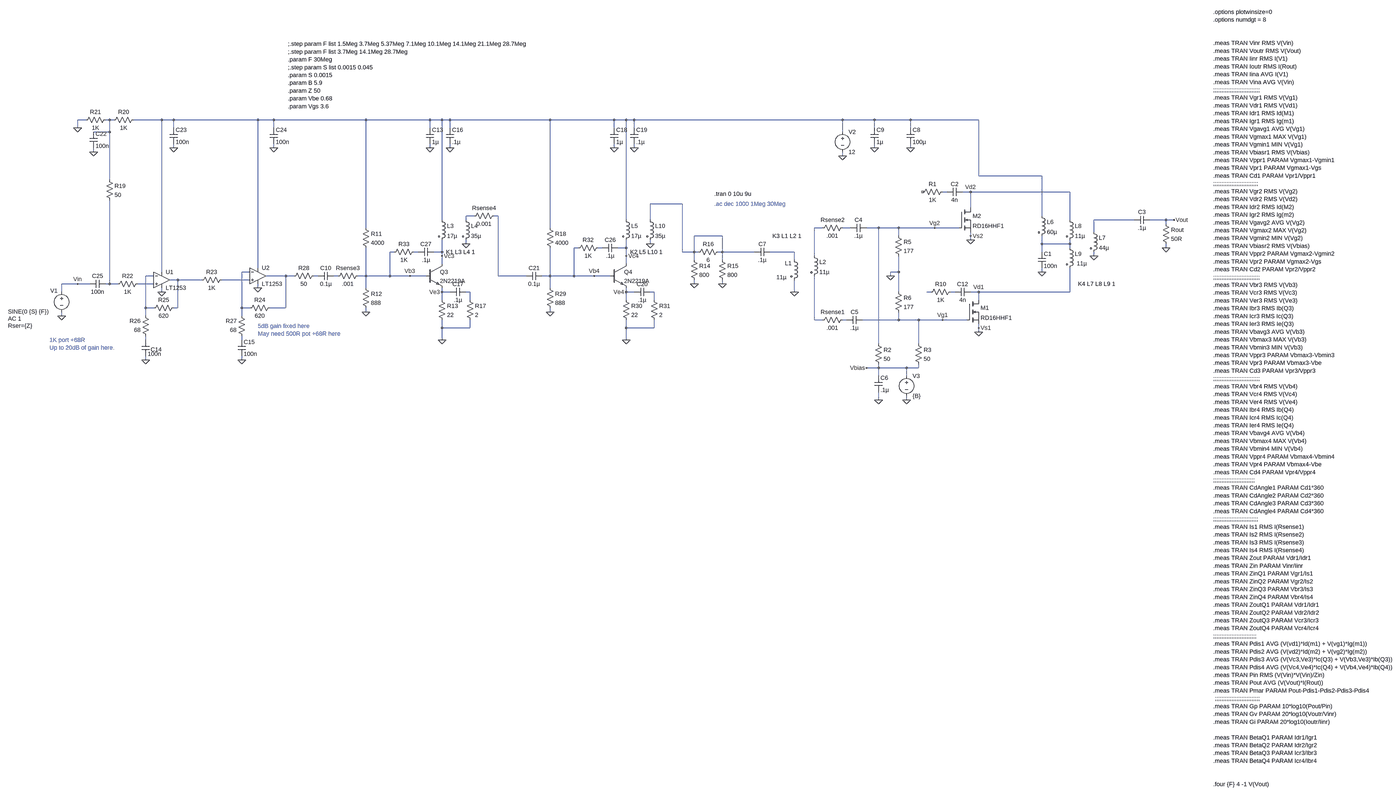
[diagram p0: schematic LT1253+2N2219+RD16HHF Push-Pull testing.asc, whole sheet]
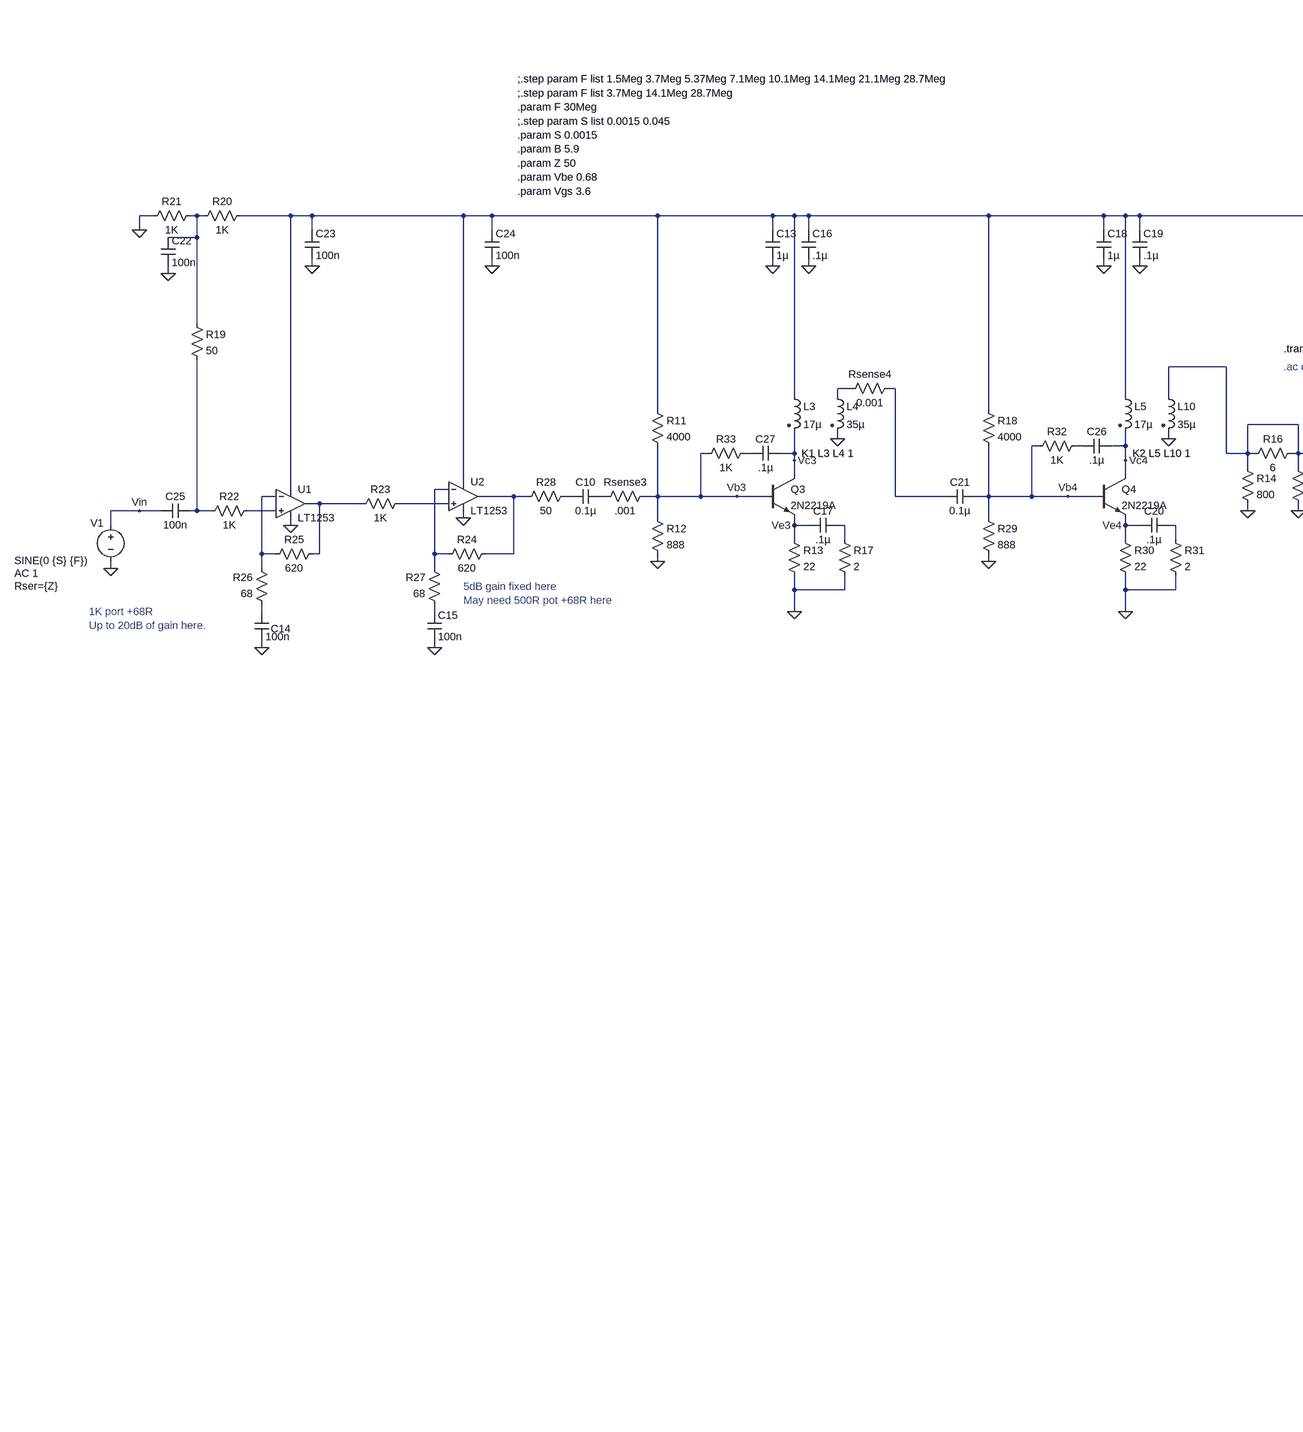
[diagram p1: schematic LT1253+2N2219+RD16HHF Push-Pull testing.asc, part, row 1 of 1, column 1 of 2]
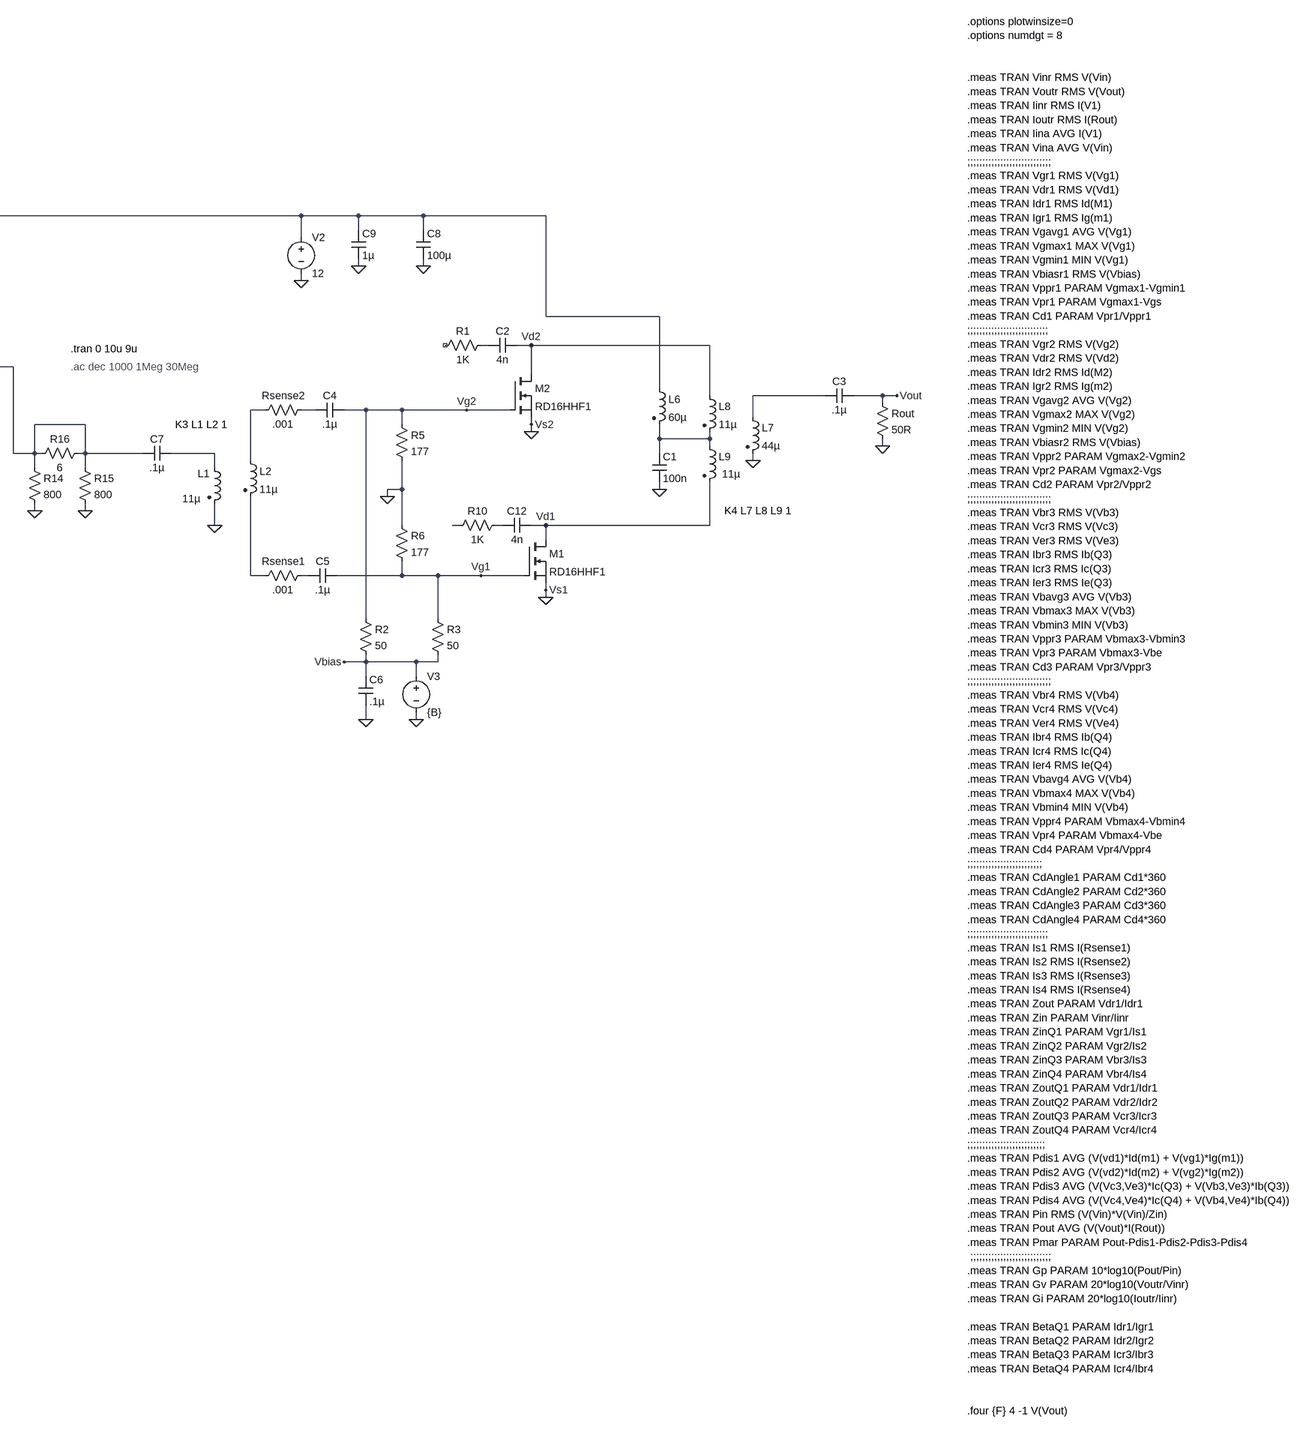
[diagram p2: schematic LT1253+2N2219+RD16HHF Push-Pull testing.asc, part, row 1 of 1, column 2 of 2]
LT1253+2N2219+RD16HHF Push-Pull testing.asc, the LTspice schematic file:
Version 4
SHEET 1 3748 1760
WIRE -2544 -624 -2576 -624
WIRE -2448 -624 -2464 -624
WIRE -2432 -624 -2448 -624
WIRE -2240 -624 -2352 -624
WIRE -2192 -624 -2240 -624
WIRE -1856 -624 -2192 -624
WIRE -1792 -624 -1856 -624
WIRE -1424 -624 -1792 -624
WIRE -1168 -624 -1424 -624
WIRE -1120 -624 -1168 -624
WIRE -1088 -624 -1120 -624
WIRE -688 -624 -1088 -624
WIRE -432 -624 -688 -624
WIRE -384 -624 -432 -624
WIRE -352 -624 -384 -624
WIRE 480 -624 -352 -624
WIRE 608 -624 480 -624
WIRE 752 -624 608 -624
WIRE 1024 -624 752 -624
WIRE -2576 -592 -2576 -624
WIRE -2192 -592 -2192 -624
WIRE -1792 -592 -1792 -624
WIRE -1168 -592 -1168 -624
WIRE -1088 -592 -1088 -624
WIRE -432 -592 -432 -624
WIRE -352 -592 -352 -624
WIRE 608 -592 608 -624
WIRE 752 -592 752 -624
WIRE -2448 -576 -2448 -624
WIRE -2448 -576 -2512 -576
WIRE 480 -576 480 -624
WIRE -2192 -512 -2192 -528
WIRE -1792 -512 -1792 -528
WIRE -1168 -512 -1168 -528
WIRE -1088 -512 -1088 -528
WIRE -432 -512 -432 -528
WIRE -352 -512 -352 -528
WIRE 608 -512 608 -528
WIRE 752 -512 752 -528
WIRE -2512 -496 -2512 -512
WIRE 480 -480 480 -496
WIRE 1024 -400 1024 -624
WIRE 1280 -400 1024 -400
WIRE -2448 -384 -2448 -576
WIRE 896 -336 880 -336
WIRE 992 -336 960 -336
WIRE 1392 -336 992 -336
WIRE -160 -288 -288 -288
WIRE 992 -272 992 -336
WIRE -992 -240 -1024 -240
WIRE -896 -240 -912 -240
WIRE 1280 -240 1280 -400
WIRE -1120 -224 -1120 -624
WIRE -1024 -224 -1024 -240
WIRE -384 -224 -384 -624
WIRE -288 -224 -288 -288
WIRE 1392 -224 1392 -336
WIRE 1648 -224 1488 -224
WIRE 1776 -224 1712 -224
WIRE 1808 -224 1776 -224
WIRE 1776 -208 1776 -224
WIRE -1424 -192 -1424 -624
WIRE -688 -192 -688 -624
WIRE 400 -192 368 -192
WIRE 512 -192 480 -192
WIRE 624 -192 576 -192
WIRE 704 -192 624 -192
WIRE 848 -192 704 -192
WIRE 944 -192 848 -192
WIRE 1488 -176 1488 -224
WIRE 0 -160 -112 -160
WIRE 704 -160 704 -192
WIRE 992 -160 992 -176
WIRE 992 -144 992 -160
WIRE -1024 -128 -1024 -144
WIRE -288 -128 -288 -144
WIRE 1280 -128 1280 -160
WIRE 1392 -128 1392 -144
WIRE 1392 -128 1280 -128
WIRE -576 -112 -592 -112
WIRE -480 -112 -496 -112
WIRE -384 -112 -384 -144
WIRE -384 -112 -416 -112
WIRE 1392 -112 1392 -128
WIRE 1776 -112 1776 -128
WIRE -1312 -96 -1328 -96
WIRE -1216 -96 -1232 -96
WIRE -1120 -96 -1120 -144
WIRE -1120 -96 -1152 -96
WIRE -160 -96 -160 -288
WIRE -112 -96 -112 -160
WIRE -112 -96 -160 -96
WIRE -96 -96 -112 -96
WIRE 0 -96 0 -160
WIRE 0 -96 -16 -96
WIRE 128 -96 0 -96
WIRE 288 -96 192 -96
WIRE 1280 -96 1280 -128
WIRE -1120 -80 -1120 -96
WIRE -384 -80 -384 -112
WIRE 368 -80 368 -192
WIRE 1488 -80 1488 -96
WIRE -112 -64 -112 -96
WIRE 0 -64 0 -96
WIRE 288 -64 288 -96
WIRE -1120 -48 -1120 -80
WIRE -384 -48 -384 -80
WIRE -1856 -32 -1856 -624
WIRE -2240 -16 -2240 -624
WIRE -1888 -16 -1920 -16
WIRE 704 -16 704 -80
WIRE 704 -16 672 -16
WIRE 1280 -16 1280 -32
WIRE -2272 0 -2304 0
WIRE -1744 0 -1824 0
WIRE -1712 0 -1744 0
WIRE -1616 0 -1632 0
WIRE -1536 0 -1552 0
WIRE -1424 0 -1424 -112
WIRE -1424 0 -1456 0
WIRE -1328 0 -1328 -96
WIRE -1328 0 -1424 0
WIRE -1248 0 -1328 0
WIRE -1184 0 -1248 0
WIRE -896 0 -896 -240
WIRE -784 0 -896 0
WIRE -688 0 -688 -112
WIRE -688 0 -720 0
WIRE -592 0 -592 -112
WIRE -592 0 -688 0
WIRE -512 0 -592 0
WIRE -448 0 -512 0
WIRE 672 0 672 -16
WIRE -2176 16 -2208 16
WIRE -2080 16 -2176 16
WIRE -1888 16 -2000 16
WIRE -2576 32 -2640 32
WIRE -2528 32 -2576 32
WIRE -2448 32 -2448 -304
WIRE -2448 32 -2464 32
WIRE -2416 32 -2448 32
WIRE -2272 32 -2336 32
WIRE -112 32 -112 16
WIRE 0 32 0 16
WIRE -1856 48 -1856 32
WIRE -1424 48 -1424 0
WIRE -688 48 -688 0
WIRE -2640 64 -2640 32
WIRE -2240 64 -2240 48
WIRE -1120 64 -1120 48
WIRE -1088 64 -1120 64
WIRE -1008 64 -1024 64
WIRE -384 64 -384 48
WIRE -352 64 -384 64
WIRE -272 64 -288 64
WIRE 288 64 288 16
WIRE 704 64 704 -16
WIRE 832 64 816 64
WIRE 928 64 912 64
WIRE 1024 64 992 64
WIRE 1392 64 1392 -32
WIRE 1392 64 1024 64
WIRE -1120 96 -1120 64
WIRE -1008 96 -1008 64
WIRE -384 96 -384 64
WIRE -272 96 -272 64
WIRE 1024 96 1024 64
WIRE -2304 128 -2304 0
WIRE -2272 128 -2304 128
WIRE -2176 128 -2176 16
WIRE -2176 128 -2192 128
WIRE -1920 128 -1920 -16
WIRE -1888 128 -1920 128
WIRE -1744 128 -1744 0
WIRE -1744 128 -1808 128
WIRE -1424 144 -1424 128
WIRE -688 144 -688 128
WIRE -2640 160 -2640 144
WIRE -2304 160 -2304 128
WIRE -1920 160 -1920 128
WIRE 368 176 368 0
WIRE 400 176 368 176
WIRE 496 176 480 176
WIRE 704 176 704 144
WIRE 704 176 560 176
WIRE 784 176 704 176
WIRE 880 176 784 176
WIRE 976 176 880 176
WIRE -1120 208 -1120 176
WIRE -1008 208 -1008 176
WIRE -1008 208 -1120 208
WIRE -384 208 -384 176
WIRE -272 208 -272 176
WIRE -272 208 -384 208
WIRE 1024 208 1024 192
WIRE 1024 224 1024 208
WIRE -2304 256 -2304 240
WIRE -1920 256 -1920 240
WIRE -1120 256 -1120 208
WIRE -384 256 -384 208
WIRE 624 272 624 -192
WIRE 784 272 784 176
WIRE -2304 336 -2304 320
WIRE -1920 336 -1920 320
WIRE 624 368 624 352
WIRE 624 368 576 368
WIRE 736 368 624 368
WIRE 784 368 784 352
WIRE 784 368 736 368
WIRE 624 400 624 368
WIRE 736 400 736 368
WIRE 624 496 624 464
WIRE 736 496 736 480
FLAG 480 -480 0
FLAG -2640 160 0
FLAG 1808 -224 Vout
FLAG 1776 -112 0
FLAG 880 176 Vg1
FLAG -2576 32 Vin
FLAG 288 64 0
FLAG 672 0 0
FLAG 1280 -16 0
FLAG 608 -512 0
FLAG 1488 -80 0
FLAG 752 -512 0
FLAG -112 32 0
FLAG 0 32 0
FLAG -2192 -512 0
FLAG -2512 -496 0
FLAG -2240 64 0
FLAG -1856 48 0
FLAG -1920 336 0
FLAG -1792 -512 0
FLAG -2576 -592 0
FLAG -2304 336 0
FLAG -1424 144 0
FLAG -1120 256 0
FLAG -1168 -512 0
FLAG -1088 -512 0
FLAG -1248 0 Vb3
FLAG -1120 64 Ve3
FLAG -1120 -80 Vc3
FLAG -1024 -128 0
FLAG -688 144 0
FLAG -384 256 0
FLAG -432 -512 0
FLAG -352 -512 0
FLAG -512 0 Vb4
FLAG -384 64 Ve4
FLAG -384 -80 Vc4
FLAG -288 -128 0
FLAG 1024 64 Vd1
FLAG 1024 224 0
FLAG 1024 208 Vs1
FLAG 848 -192 Vg2
FLAG 992 -336 Vd2
FLAG 992 -144 0
FLAG 992 -160 Vs2
FLAG 736 496 0
FLAG 624 496 0
FLAG 576 368 Vbias
SYMBOL voltage -2640 48 R0
WINDOW 0 -45 11 Left 2
WINDOW 3 -214 95 Left 2
WINDOW 123 -214 123 Left 2
WINDOW 39 -214 151 Left 2
SYMATTR InstName V1
SYMATTR Value SINE(0 {S} {F})
SYMATTR Value2 AC 1
SYMATTR SpiceLine Rser={Z}
SYMBOL voltage 480 -592 R0
WINDOW 123 0 0 Left 0
WINDOW 39 0 0 Left 0
SYMATTR InstName V2
SYMATTR Value 12
SYMBOL cap 1712 -240 R90
WINDOW 0 0 32 VBottom 2
WINDOW 3 32 32 VTop 2
SYMATTR InstName C3
SYMATTR Value .1µ
SYMBOL res 1760 -224 R0
SYMATTR InstName Rout
SYMATTR Value 50R
SYMBOL cap 192 -112 R90
WINDOW 0 0 32 VBottom 2
WINDOW 3 32 32 VTop 2
SYMATTR InstName C7
SYMATTR Value .1µ
SYMBOL ind2 272 -80 R0
WINDOW 0 -22 29 Left 2
WINDOW 3 -56 85 Left 2
SYMATTR InstName L1
SYMATTR Value 11µ
SYMATTR Type ind
SYMBOL ind2 352 -96 R0
SYMATTR InstName L2
SYMATTR Value 11µ
SYMATTR Type ind
SYMBOL res 688 -176 R0
SYMATTR InstName R5
SYMATTR Value 177
SYMBOL res 688 48 R0
SYMATTR InstName R6
SYMATTR Value 177
SYMBOL ind2 1376 -240 R0
SYMATTR InstName L8
SYMATTR Value 11µ
SYMATTR Type ind
SYMBOL ind2 1376 -128 R0
WINDOW 3 43 78 Left 2
SYMATTR Value 11µ
SYMATTR InstName L9
SYMATTR Type ind
SYMBOL ind2 1472 -192 R0
SYMATTR InstName L7
SYMATTR Value 44µ
SYMATTR Type ind
SYMBOL ind2 1264 -256 R0
SYMATTR InstName L6
SYMATTR Value 60µ
SYMATTR Type ind
SYMBOL cap 1264 -96 R0
SYMATTR InstName C1
SYMATTR Value 100n
SYMBOL cap 592 -592 R0
SYMATTR InstName C9
SYMATTR Value 1µ
SYMBOL cap 736 -592 R0
SYMATTR InstName C8
SYMATTR Value 100µ
SYMBOL res 496 -208 R90
WINDOW 0 0 56 VBottom 2
WINDOW 3 32 56 VTop 2
SYMATTR InstName Rsense2
SYMATTR Value .001
SYMBOL res 496 160 R90
WINDOW 0 0 56 VBottom 2
WINDOW 3 32 56 VTop 2
SYMATTR InstName Rsense1
SYMATTR Value .001
SYMBOL cap 576 -208 R90
WINDOW 0 0 32 VBottom 2
WINDOW 3 32 32 VTop 2
SYMATTR InstName C4
SYMATTR Value .1µ
SYMBOL cap 560 160 R90
WINDOW 0 0 32 VBottom 2
WINDOW 3 32 32 VTop 2
SYMATTR InstName C5
SYMATTR Value .1µ
SYMBOL cap 992 48 R90
WINDOW 0 0 32 VBottom 2
WINDOW 3 32 32 VTop 2
SYMATTR InstName C12
SYMATTR Value 4n
SYMBOL res 928 48 R90
WINDOW 0 0 56 VBottom 2
WINDOW 3 32 56 VTop 2
SYMATTR InstName R10
SYMATTR Value 1K
SYMBOL res -128 -80 R0
SYMATTR InstName R14
SYMATTR Value 800
SYMBOL res -16 -80 R0
SYMATTR InstName R15
SYMATTR Value 800
SYMBOL res 0 -112 R90
WINDOW 0 0 56 VBottom 2
WINDOW 3 32 56 VTop 2
SYMATTR InstName R16
SYMATTR Value 6
SYMBOL Opamps\\LT1253 -2240 -48 R0
SYMATTR InstName U1
SYMBOL Opamps\\LT1253 -1856 -64 R0
SYMATTR InstName U2
SYMBOL res -2464 -400 R0
SYMATTR InstName R19
SYMATTR Value 50
SYMBOL res -2336 -640 R90
WINDOW 0 0 56 VBottom 2
WINDOW 3 32 56 VTop 2
SYMATTR InstName R20
SYMATTR Value 1K
SYMBOL res -2448 -640 R90
WINDOW 0 0 56 VBottom 2
WINDOW 3 32 56 VTop 2
SYMATTR InstName R21
SYMATTR Value 1K
SYMBOL res -2320 16 R90
WINDOW 0 0 56 VBottom 2
WINDOW 3 32 56 VTop 2
SYMATTR InstName R22
SYMATTR Value 1K
SYMBOL res -1984 0 R90
WINDOW 0 0 56 VBottom 2
WINDOW 3 32 56 VTop 2
SYMATTR InstName R23
SYMATTR Value 1K
SYMBOL res -1792 112 R90
WINDOW 0 0 56 VBottom 2
WINDOW 3 32 56 VTop 2
SYMATTR InstName R24
SYMATTR Value 620
SYMBOL res -2176 112 R90
WINDOW 0 0 56 VBottom 2
WINDOW 3 32 56 VTop 2
SYMATTR InstName R25
SYMATTR Value 620
SYMBOL res -2288 256 R180
WINDOW 0 36 76 Left 2
WINDOW 3 36 40 Left 2
SYMATTR InstName R26
SYMATTR Value 68
SYMBOL res -1904 256 R180
WINDOW 0 36 76 Left 2
WINDOW 3 36 40 Left 2
SYMATTR InstName R27
SYMATTR Value 68
SYMBOL cap -2320 256 R0
WINDOW 0 36 38 Left 2
SYMATTR InstName C14
SYMATTR Value 100n
SYMBOL cap -1936 256 R0
SYMATTR InstName C15
SYMATTR Value 100n
SYMBOL cap -2528 -576 R0
SYMATTR InstName C22
SYMATTR Value 100n
SYMBOL cap -2208 -592 R0
SYMATTR InstName C23
SYMATTR Value 100n
SYMBOL cap -1808 -592 R0
SYMATTR InstName C24
SYMATTR Value 100n
SYMBOL cap -2464 16 R90
WINDOW 0 0 32 VBottom 2
WINDOW 3 32 32 VTop 2
SYMATTR InstName C25
SYMATTR Value 100n
SYMBOL res -1616 -16 R90
WINDOW 0 0 56 VBottom 2
WINDOW 3 32 56 VTop 2
SYMATTR InstName R28
SYMATTR Value 50
SYMBOL res -1440 -16 R90
WINDOW 0 0 56 VBottom 2
WINDOW 3 32 56 VTop 2
SYMATTR InstName Rsense3
SYMATTR Value .001
SYMBOL res -1440 -208 R0
SYMATTR InstName R11
SYMATTR Value 4000
SYMBOL res -1440 32 R0
SYMATTR InstName R12
SYMATTR Value 888
SYMBOL res -1136 80 R0
SYMATTR InstName R13
SYMATTR Value 22
SYMBOL ind2 -1136 -240 R0
SYMATTR InstName L3
SYMATTR Value 17µ
SYMATTR Type ind
SYMBOL cap -1184 -592 R0
SYMATTR InstName C13
SYMATTR Value 1µ
SYMBOL cap -1104 -592 R0
SYMATTR InstName C16
SYMATTR Value .1µ
SYMBOL cap -1024 48 R90
WINDOW 0 0 32 VBottom 2
WINDOW 3 32 32 VTop 2
SYMATTR InstName C17
SYMATTR Value .1µ
SYMBOL ind2 -1040 -240 R0
SYMATTR InstName L4
SYMATTR Value 35µ
SYMATTR Type ind
SYMBOL npn -1184 -48 R0
SYMATTR InstName Q3
SYMATTR Value 2N2219A
SYMBOL res -1024 80 R0
SYMATTR InstName R17
SYMATTR Value 2
SYMBOL res -704 -208 R0
SYMATTR InstName R18
SYMATTR Value 4000
SYMBOL res -704 32 R0
SYMATTR InstName R29
SYMATTR Value 888
SYMBOL res -400 80 R0
SYMATTR InstName R30
SYMATTR Value 22
SYMBOL ind2 -400 -240 R0
SYMATTR InstName L5
SYMATTR Value 17µ
SYMATTR Type ind
SYMBOL cap -448 -592 R0
SYMATTR InstName C18
SYMATTR Value 1µ
SYMBOL cap -368 -592 R0
SYMATTR InstName C19
SYMATTR Value .1µ
SYMBOL cap -288 48 R90
WINDOW 0 0 32 VBottom 2
WINDOW 3 32 32 VTop 2
SYMATTR InstName C20
SYMATTR Value .1µ
SYMBOL ind2 -304 -240 R0
SYMATTR InstName L10
SYMATTR Value 35µ
SYMATTR Type ind
SYMBOL npn -448 -48 R0
SYMATTR InstName Q4
SYMATTR Value 2N2219A
SYMBOL res -288 80 R0
SYMATTR InstName R31
SYMATTR Value 2
SYMBOL cap -720 -16 R90
WINDOW 0 0 32 VBottom 2
WINDOW 3 32 32 VTop 2
SYMATTR InstName C21
SYMATTR Value 0.1µ
SYMBOL res -896 -256 R90
WINDOW 0 0 56 VBottom 2
WINDOW 3 32 56 VTop 2
SYMATTR InstName Rsense4
SYMATTR Value 0.001
SYMBOL cap -416 -128 R90
WINDOW 0 0 32 VBottom 2
WINDOW 3 32 32 VTop 2
SYMATTR InstName C26
SYMATTR Value .1µ
SYMBOL res -480 -128 R90
WINDOW 0 0 56 VBottom 2
WINDOW 3 32 56 VTop 2
SYMATTR InstName R32
SYMATTR Value 1K
SYMBOL cap -1152 -112 R90
WINDOW 0 0 32 VBottom 2
WINDOW 3 32 32 VTop 2
SYMATTR InstName C27
SYMATTR Value .1µ
SYMBOL res -1216 -112 R90
WINDOW 0 0 56 VBottom 2
WINDOW 3 32 56 VTop 2
SYMATTR InstName R33
SYMATTR Value 1K
SYMBOL nmos 976 96 R0
SYMATTR InstName M1
SYMATTR Value RD16HHF1
SYMBOL cap 960 -352 R90
WINDOW 0 0 32 VBottom 2
WINDOW 3 32 32 VTop 2
SYMATTR InstName C2
SYMATTR Value 4n
SYMBOL res 896 -352 R90
WINDOW 0 0 56 VBottom 2
WINDOW 3 32 56 VTop 2
SYMATTR InstName R1
SYMATTR Value 1K
SYMBOL nmos 944 -272 R0
SYMATTR InstName M2
SYMATTR Value RD16HHF1
SYMBOL voltage 736 384 R0
WINDOW 123 0 0 Left 2
WINDOW 39 0 0 Left 2
SYMATTR InstName V3
SYMATTR Value {B}
SYMBOL res 608 256 R0
SYMATTR InstName R2
SYMATTR Value 50
SYMBOL cap 608 400 R0
SYMATTR InstName C6
SYMATTR Value .1µ
SYMBOL res 768 256 R0
SYMATTR InstName R3
SYMATTR Value 50
SYMBOL cap -1552 -16 R90
WINDOW 0 0 32 VBottom 2
WINDOW 3 32 32 VTop 2
SYMATTR InstName C10
SYMATTR Value 0.1µ
TEXT -32 -328 Left 2 !.tran 0 10u 9u
TEXT 2248 -1056 Left 2 !.options plotwinsize=0\n.options numdgt = 8\n \n \n.meas TRAN Vinr RMS V(Vin)\n.meas TRAN Voutr RMS V(Vout)\n.meas TRAN Iinr RMS I(V1)\n.meas TRAN Ioutr RMS I(Rout)\n.meas TRAN Iina AVG I(V1)\n.meas TRAN Vina AVG V(Vin)\n;;;;;;;;;;;;;;;;;;;;;;;;;;;;\n.meas TRAN Vgr1 RMS V(Vg1)\n.meas TRAN Vdr1 RMS V(Vd1)\n.meas TRAN Idr1 RMS Id(M1)\n.meas TRAN Igr1 RMS Ig(m1)\n.meas TRAN Vgavg1 AVG V(Vg1)\n.meas TRAN Vgmax1 MAX V(Vg1)\n.meas TRAN Vgmin1 MIN V(Vg1)\n.meas TRAN Vbiasr1 RMS V(Vbias)\n.meas TRAN Vppr1 PARAM Vgmax1-Vgmin1\n.meas TRAN Vpr1 PARAM Vgmax1-Vgs\n.meas TRAN Cd1 PARAM Vpr1/Vppr1\n;;;;;;;;;;;;;;;;;;;;;;;;;;;\n.meas TRAN Vgr2 RMS V(Vg2)\n.meas TRAN Vdr2 RMS V(Vd2)\n.meas TRAN Idr2 RMS Id(M2)\n.meas TRAN Igr2 RMS Ig(m2)\n.meas TRAN Vgavg2 AVG V(Vg2)\n.meas TRAN Vgmax2 MAX V(Vg2)\n.meas TRAN Vgmin2 MIN V(Vg2)\n.meas TRAN Vbiasr2 RMS V(Vbias)\n.meas TRAN Vppr2 PARAM Vgmax2-Vgmin2\n.meas TRAN Vpr2 PARAM Vgmax2-Vgs\n.meas TRAN Cd2 PARAM Vpr2/Vppr2\n;;;;;;;;;;;;;;;;;;;;;;;;;;;;\n.meas TRAN Vbr3 RMS V(Vb3)\n.meas TRAN Vcr3 RMS V(Vc3)\n.meas TRAN Ver3 RMS V(Ve3)\n.meas TRAN Ibr3 RMS Ib(Q3)\n.meas TRAN Icr3 RMS Ic(Q3)\n.meas TRAN Ier3 RMS Ie(Q3)\n.meas TRAN Vbavg3 AVG V(Vb3)\n.meas TRAN Vbmax3 MAX V(Vb3)\n.meas TRAN Vbmin3 MIN V(Vb3)\n.meas TRAN Vppr3 PARAM Vbmax3-Vbmin3\n.meas TRAN Vpr3 PARAM Vbmax3-Vbe\n.meas TRAN Cd3 PARAM Vpr3/Vppr3\n;;;;;;;;;;;;;;;;;;;;;;;;;;;;\n.meas TRAN Vbr4 RMS V(Vb4)\n.meas TRAN Vcr4 RMS V(Vc4)\n.meas TRAN Ver4 RMS V(Ve4)\n.meas TRAN Ibr4 RMS Ib(Q4)\n.meas TRAN Icr4 RMS Ic(Q4)\n.meas TRAN Ier4 RMS Ie(Q4)\n.meas TRAN Vbavg4 AVG V(Vb4)\n.meas TRAN Vbmax4 MAX V(Vb4)\n.meas TRAN Vbmin4 MIN V(Vb4)\n.meas TRAN Vppr4 PARAM Vbmax4-Vbmin4\n.meas TRAN Vpr4 PARAM Vbmax4-Vbe\n.meas TRAN Cd4 PARAM Vpr4/Vppr4\n;;;;;;;;;;;;;;;;;;;;;;;;;\n.meas TRAN CdAngle1 PARAM Cd1*360\n.meas TRAN CdAngle2 PARAM Cd2*360\n.meas TRAN CdAngle3 PARAM Cd3*360\n.meas TRAN CdAngle4 PARAM Cd4*360\n;;;;;;;;;;;;;;;;;;;;;;;;;;;\n.meas TRAN Is1 RMS I(Rsense1)\n.meas TRAN Is2 RMS I(Rsense2)\n.meas TRAN Is3 RMS I(Rsense3)\n.meas TRAN Is4 RMS I(Rsense4)\n.meas TRAN Zout PARAM Vdr1/Idr1\n.meas TRAN Zin PARAM Vinr/Iinr\n.meas TRAN ZinQ1 PARAM Vgr1/Is1\n.meas TRAN ZinQ2 PARAM Vgr2/Is2 \n.meas TRAN ZinQ3 PARAM Vbr3/Is3 \n.meas TRAN ZinQ4 PARAM Vbr4/Is4 \n.meas TRAN ZoutQ1 PARAM Vdr1/Idr1\n.meas TRAN ZoutQ2 PARAM Vdr2/Idr2\n.meas TRAN ZoutQ3 PARAM Vcr3/Icr3\n.meas TRAN ZoutQ4 PARAM Vcr4/Icr4\n;;;;;;;;;;;;;;;;;;;;;;;;;;\n.meas TRAN Pdis1 AVG (V(vd1)*Id(m1) + V(vg1)*Ig(m1))\n.meas TRAN Pdis2 AVG (V(vd2)*Id(m2) + V(vg2)*Ig(m2))\n.meas TRAN Pdis3 AVG (V(Vc3,Ve3)*Ic(Q3) + V(Vb3,Ve3)*Ib(Q3))\n.meas TRAN Pdis4 AVG (V(Vc4,Ve4)*Ic(Q4) + V(Vb4,Ve4)*Ib(Q4))\n.meas TRAN Pin RMS (V(Vin)*V(Vin)/Zin)\n.meas TRAN Pout AVG (V(Vout)*I(Rout))\n.meas TRAN Pmar PARAM Pout-Pdis1-Pdis2-Pdis3-Pdis4\n ;;;;;;;;;;;;;;;;;;;;;;;;;;;\n.meas TRAN Gp PARAM 10*log10(Pout/Pin)\n.meas TRAN Gv PARAM 20*log10(Voutr/Vinr)\n.meas TRAN Gi PARAM 20*log10(Ioutr/Iinr)\n \n.meas TRAN BetaQ1 PARAM Idr1/Igr1\n.meas TRAN BetaQ2 PARAM Idr2/Igr2\n.meas TRAN BetaQ3 PARAM Icr3/Ibr3\n.meas TRAN BetaQ4 PARAM Icr4/Ibr4\n \n \n.four {F} 4 -1 V(Vout)
TEXT -1736 -928 Left 2 !;.step param F list 1.5Meg 3.7Meg 5.37Meg 7.1Meg 10.1Meg 14.1Meg 21.1Meg 28.7Meg\n;.step param F list 3.7Meg 14.1Meg 28.7Meg\n.param F 30Meg\n;.step param S list 0.0015 0.045\n.param S 0.0015\n.param B 5.9\n.param Z 50\n.param Vbe 0.68\n.param Vgs 3.6
TEXT -32 -288 Left 2 ;.ac dec 1000 1Meg 30Meg
TEXT 1424 32 Left 2 !K4 L7 L8 L9 1
TEXT 200 -160 Left 2 !K3 L1 L2 1
TEXT -1856 200 Left 2 ;5dB gain fixed here\nMay need 500R pot +68R here
TEXT -2688 256 Left 2 ;1K port +68R  \nUp to 20dB of gain here.
TEXT -1104 -96 Left 2 !K1 L3 L4 1
TEXT -368 -96 Left 2 !K2 L5 L10 1

The netlist it stands for:
* LT1253+2N2219+RD16HHF Push-Pull testing.asc
V1 Vin 0 SINE(0 {S} {F}) AC 1 Rser={Z}
V2 N002 0 12
C3 Vout N007 .1µ
Rout Vout 0 50R
C7 N013 N004 .1µ
L1 N013 0 11µ
L2 N008 N027 11µ
R5 Vg2 0 177
R6 0 Vg1 177
L8 Vd2 N010 11µ
L9 N010 Vd1 11µ
L7 N007 0 44µ
L6 N002 N010 60µ
C1 N010 0 100n
C9 N002 0 1µ
C8 N002 0 100µ
Rsense2 N009 N008 .001
Rsense1 N028 N027 .001
C4 Vg2 N009 .1µ
C5 Vg1 N028 .1µ
C12 Vd1 N026 4n
R10 N026 N025 1K
R14 N004 0 800
R15 N004 0 800
R16 N004 N004 6
XU1 N022 N015 N002 0 N019 LT1253  ; pins In+ In- V+ V- OUT
XU2 N020 N014 N002 0 N016 LT1253  ; pins In+ In- V+ V- OUT
R19 N001 N021 50
R20 N002 N001 1K
R21 N001 0 1K
R22 N022 N021 1K
R23 N020 N019 1K
R24 N016 N014 620
R25 N019 N015 620
R26 N029 N015 68
R27 N030 N014 68
C14 N029 0 100n
C15 N030 0 100n
C22 N001 0 100n
C23 N002 0 100n
C24 N002 0 100n
C25 N021 Vin 100n
R28 N017 N016 50
Rsense3 Vb3 N018 .001
R11 N002 Vb3 4000
R12 Vb3 0 888
R13 Ve3 0 22
L3 N002 Vc3 17µ
C13 N002 0 1µ
C16 N002 0 .1µ
C17 N023 Ve3 .1µ
L4 N005 0 35µ
Q3 Vc3 Vb3 Ve3 0 2N2219A
R17 N023 0 2
R18 N002 Vb4 4000
R29 Vb4 0 888
R30 Ve4 0 22
L5 N002 Vc4 17µ
C18 N002 0 1µ
C19 N002 0 .1µ
C20 N024 Ve4 .1µ
L10 N004 0 35µ
Q4 Vc4 Vb4 Ve4 0 2N2219A
R31 N024 0 2
C21 Vb4 N006 0.1µ
Rsense4 N006 N005 0.001
C26 Vc4 N011 .1µ
R32 N011 Vb4 1K
C27 Vc3 N012 .1µ
R33 N012 Vb3 1K
M1 Vd1 Vg1 0 0 RD16HHF1
C2 Vd2 N003 4n
R1 N003 NC_01 1K
M2 Vd2 Vg2 0 0 RD16HHF1
V3 Vbias 0 {B}
R2 Vg2 Vbias 50
C6 Vbias 0 .1µ
R3 Vg1 Vbias 50
C10 N018 N017 0.1µ
.model NPN NPN
.model PNP PNP
.lib standard.bjt
.model NMOS NMOS
.model PMOS PMOS
.lib standard.mos
.tran 0 10u 9u
.options plotwinsize=0
.options numdgt = 8
.meas TRAN Vinr RMS V(Vin)
.meas TRAN Voutr RMS V(Vout)
.meas TRAN Iinr RMS I(V1)
.meas TRAN Ioutr RMS I(Rout)
.meas TRAN Iina AVG I(V1)
.meas TRAN Vina AVG V(Vin)
;;;;;;;;;;;;;;;;;;;;;;;;;;;;
.meas TRAN Vgr1 RMS V(Vg1)
.meas TRAN Vdr1 RMS V(Vd1)
.meas TRAN Idr1 RMS Id(M1)
.meas TRAN Igr1 RMS Ig(m1)
.meas TRAN Vgavg1 AVG V(Vg1)
.meas TRAN Vgmax1 MAX V(Vg1)
.meas TRAN Vgmin1 MIN V(Vg1)
.meas TRAN Vbiasr1 RMS V(Vbias)
.meas TRAN Vppr1 PARAM Vgmax1-Vgmin1
.meas TRAN Vpr1 PARAM Vgmax1-Vgs
.meas TRAN Cd1 PARAM Vpr1/Vppr1
;;;;;;;;;;;;;;;;;;;;;;;;;;;
.meas TRAN Vgr2 RMS V(Vg2)
.meas TRAN Vdr2 RMS V(Vd2)
.meas TRAN Idr2 RMS Id(M2)
.meas TRAN Igr2 RMS Ig(m2)
.meas TRAN Vgavg2 AVG V(Vg2)
.meas TRAN Vgmax2 MAX V(Vg2)
.meas TRAN Vgmin2 MIN V(Vg2)
.meas TRAN Vbiasr2 RMS V(Vbias)
.meas TRAN Vppr2 PARAM Vgmax2-Vgmin2
.meas TRAN Vpr2 PARAM Vgmax2-Vgs
.meas TRAN Cd2 PARAM Vpr2/Vppr2
;;;;;;;;;;;;;;;;;;;;;;;;;;;;
.meas TRAN Vbr3 RMS V(Vb3)
.meas TRAN Vcr3 RMS V(Vc3)
.meas TRAN Ver3 RMS V(Ve3)
.meas TRAN Ibr3 RMS Ib(Q3)
.meas TRAN Icr3 RMS Ic(Q3)
.meas TRAN Ier3 RMS Ie(Q3)
.meas TRAN Vbavg3 AVG V(Vb3)
.meas TRAN Vbmax3 MAX V(Vb3)
.meas TRAN Vbmin3 MIN V(Vb3)
.meas TRAN Vppr3 PARAM Vbmax3-Vbmin3
.meas TRAN Vpr3 PARAM Vbmax3-Vbe
.meas TRAN Cd3 PARAM Vpr3/Vppr3
;;;;;;;;;;;;;;;;;;;;;;;;;;;;
.meas TRAN Vbr4 RMS V(Vb4)
.meas TRAN Vcr4 RMS V(Vc4)
.meas TRAN Ver4 RMS V(Ve4)
.meas TRAN Ibr4 RMS Ib(Q4)
.meas TRAN Icr4 RMS Ic(Q4)
.meas TRAN Ier4 RMS Ie(Q4)
.meas TRAN Vbavg4 AVG V(Vb4)
.meas TRAN Vbmax4 MAX V(Vb4)
.meas TRAN Vbmin4 MIN V(Vb4)
.meas TRAN Vppr4 PARAM Vbmax4-Vbmin4
.meas TRAN Vpr4 PARAM Vbmax4-Vbe
.meas TRAN Cd4 PARAM Vpr4/Vppr4
;;;;;;;;;;;;;;;;;;;;;;;;;
.meas TRAN CdAngle1 PARAM Cd1*360
.meas TRAN CdAngle2 PARAM Cd2*360
.meas TRAN CdAngle3 PARAM Cd3*360
.meas TRAN CdAngle4 PARAM Cd4*360
;;;;;;;;;;;;;;;;;;;;;;;;;;;
.meas TRAN Is1 RMS I(Rsense1)
.meas TRAN Is2 RMS I(Rsense2)
.meas TRAN Is3 RMS I(Rsense3)
.meas TRAN Is4 RMS I(Rsense4)
.meas TRAN Zout PARAM Vdr1/Idr1
.meas TRAN Zin PARAM Vinr/Iinr
.meas TRAN ZinQ1 PARAM Vgr1/Is1
.meas TRAN ZinQ2 PARAM Vgr2/Is2
.meas TRAN ZinQ3 PARAM Vbr3/Is3
.meas TRAN ZinQ4 PARAM Vbr4/Is4
.meas TRAN ZoutQ1 PARAM Vdr1/Idr1
.meas TRAN ZoutQ2 PARAM Vdr2/Idr2
.meas TRAN ZoutQ3 PARAM Vcr3/Icr3
.meas TRAN ZoutQ4 PARAM Vcr4/Icr4
;;;;;;;;;;;;;;;;;;;;;;;;;;
.meas TRAN Pdis1 AVG (V(vd1)*Id(m1) + V(vg1)*Ig(m1))
.meas TRAN Pdis2 AVG (V(vd2)*Id(m2) + V(vg2)*Ig(m2))
.meas TRAN Pdis3 AVG (V(Vc3,Ve3)*Ic(Q3) + V(Vb3,Ve3)*Ib(Q3))
.meas TRAN Pdis4 AVG (V(Vc4,Ve4)*Ic(Q4) + V(Vb4,Ve4)*Ib(Q4))
.meas TRAN Pin RMS (V(Vin)*V(Vin)/Zin)
.meas TRAN Pout AVG (V(Vout)*I(Rout))
.meas TRAN Pmar PARAM Pout-Pdis1-Pdis2-Pdis3-Pdis4
 ;;;;;;;;;;;;;;;;;;;;;;;;;;;
.meas TRAN Gp PARAM 10*log10(Pout/Pin)
.meas TRAN Gv PARAM 20*log10(Voutr/Vinr)
.meas TRAN Gi PARAM 20*log10(Ioutr/Iinr)
.meas TRAN BetaQ1 PARAM Idr1/Igr1
.meas TRAN BetaQ2 PARAM Idr2/Igr2
.meas TRAN BetaQ3 PARAM Icr3/Ibr3
.meas TRAN BetaQ4 PARAM Icr4/Ibr4
.four {F} 4 -1 V(Vout)
;.step param F list 1.5Meg 3.7Meg 5.37Meg 7.1Meg 10.1Meg 14.1Meg 21.1Meg 28.7Meg
;.step param F list 3.7Meg 14.1Meg 28.7Meg
.param F 30Meg
;.step param S list 0.0015 0.045
.param S 0.0015
.param B 5.9
.param Z 50
.param Vbe 0.68
.param Vgs 3.6
* .ac dec 1000 1Meg 30Meg
K4 L7 L8 L9 1
K3 L1 L2 1
* 5dB gain fixed here
* May need 500R pot +68R here
* 1K port +68R
* Up to 20dB of gain here.
K1 L3 L4 1
K2 L5 L10 1
.backanno
.end